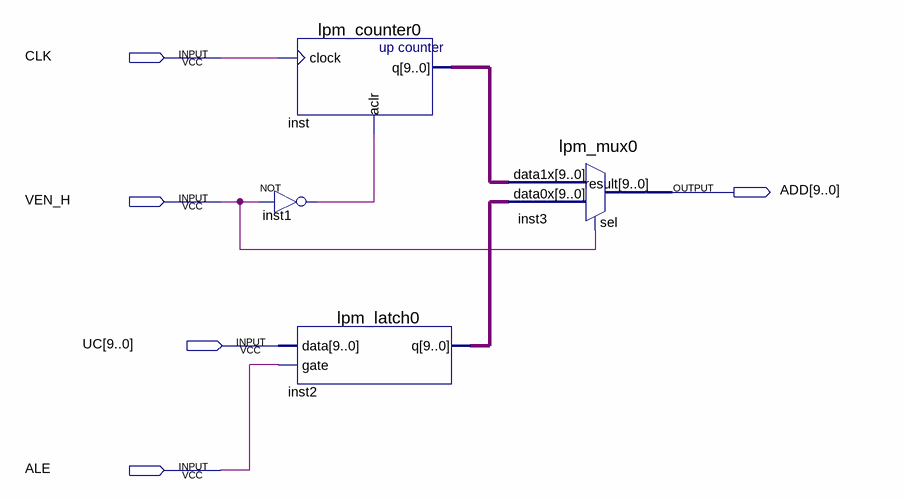
[diagram p0: schematic sheet]
// Quartus schematic VGA2.bdf as structural Verilog: 4 symbols, 5 pins
module VGA2 (
  input  CLK,
  input  VEN_H,
  input  [9:0] UC,
  input  ALE,
  output [9:0] ADD
);

  wire inst1_out;
  wire [9:0] inst2_q, inst_q;

  lpm_counter0 inst (.clock(CLK), .aclr(inst1_out), .q(inst_q));
  not inst1 (inst1_out, VEN_H);
  lpm_latch0 inst2 (.data(UC), .gate(ALE), .q(inst2_q));
  lpm_mux0 inst3 (.data1x(inst_q), .data0x(inst2_q), .sel(VEN_H), .result(ADD));
endmodule
